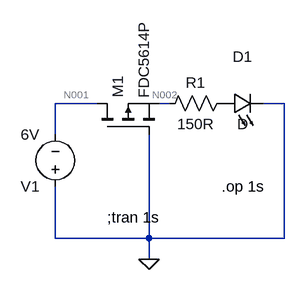
[diagram p0: schematic Draft1.asc]
Draft1.asc, the LTspice schematic file:
Version 4
SHEET 1 880 680
WIRE 256 176 192 176
WIRE 368 176 352 176
WIRE 544 176 512 176
WIRE 192 224 192 176
WIRE 192 384 192 304
WIRE 336 384 336 224
WIRE 336 384 192 384
WIRE 544 384 544 176
WIRE 544 384 336 384
WIRE 336 416 336 384
FLAG 336 416 0
DATAFLAG 192 208 ""
DATAFLAG 336 272 ""
SYMBOL pmos 256 224 R270
SYMATTR InstName M1
SYMATTR Value FDC5614P
SYMBOL voltage 192 320 R180
WINDOW 123 0 0 Left 0
WINDOW 39 0 0 Left 0
SYMATTR InstName V1
SYMATTR Value 6V
SYMBOL LED 448 192 R270
WINDOW 0 72 32 VTop 2
WINDOW 3 0 32 VBottom 2
SYMATTR InstName D1
SYMBOL res 464 160 R90
WINDOW 0 0 56 VBottom 2
WINDOW 3 32 56 VTop 2
SYMATTR InstName R1
SYMATTR Value 150R
TEXT 272 352 Left 2 !;tran 1s
TEXT 448 304 Left 2 !.op 1s

The netlist it stands for:
* Draft1.asc
M1 N001 0 N002 N002 FDC5614P
V1 0 N001 6V
D1 P001 0 D
R1 P001 N002 150R
.model D D
.lib standard.dio
.model NMOS NMOS
.model PMOS PMOS
.lib standard.mos
;tran 1s
.op 1s
.backanno
.end

* Results of the author's LTspice run, read from the files saved beside the schematic
* Operating Point:
*   V(n001) = -6 V
*   V(n002) = -5.989 V
*   V(p001) = -5.989 V
*   Id(M1) = 62.62 pA
*   Ig(M1) = -68.63 pA
*   Is(M1) = 6.006 pA
*   I(D1) = -5.999 pA
*   I(R1) = 5.999 pA
*   I(V1) = -5.969 pA
* From the log:
*   Semiconductor Device Operating Points:
*                           --- Diodes ---
*   Name:      d1
*   Model:      d
*   Id:        NaN
*   Vd:      -5.99e+0
*   Req:       NaN
*   CAP:      0.00e+0
*                           --- VDMOSFET Transistors ---
*   Name:          m1
*   Model:      fdc5614p
*   Id:            NaN
*   Vgs:          5.99e+0
*   Vds:         -1.11e-2
*   Vth:         -1.85e+0
*   Gm:           0.00e+0
*   Gds:          0.00e+0
*   Cgs:           NaN
*   Cgd:           NaN
*   Cbody:         NaN